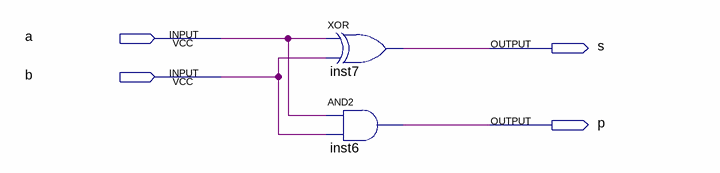
[diagram p0: schematic sheet]
// Quartus schematic HA.bdf as structural Verilog: 2 symbols, 4 pins
module HA (
  input  a,
  input  b,
  output s,
  output p
);

  xor inst7 (s, a, b);
  and inst6 (p, a, b);
endmodule
